# Altium schematic sheet Artix7_ProgramAndConfig.SchDoc
size A2; SheetNumber: 10; SheetTotal: 14
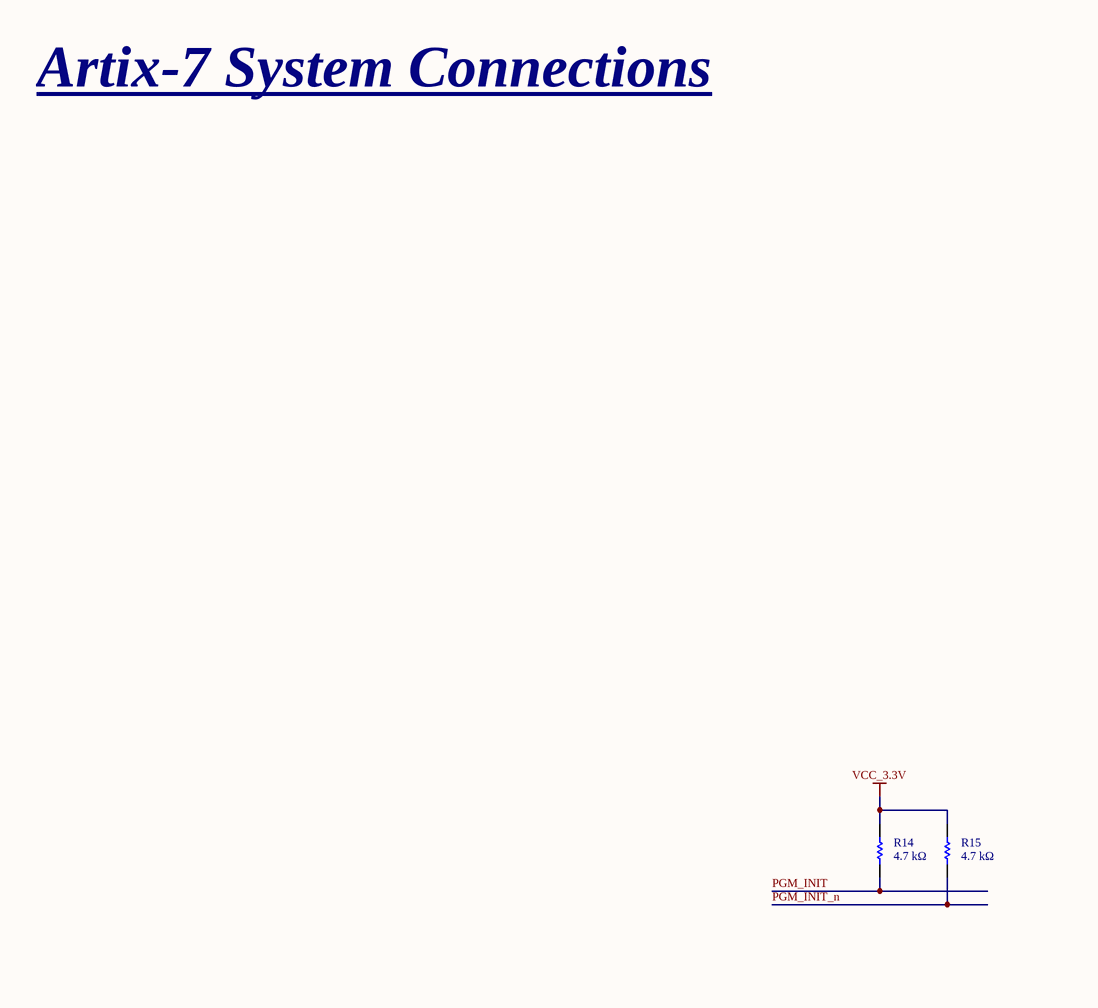
[diagram p0: Artix7_ProgramAndConfig.SchDoc, left]
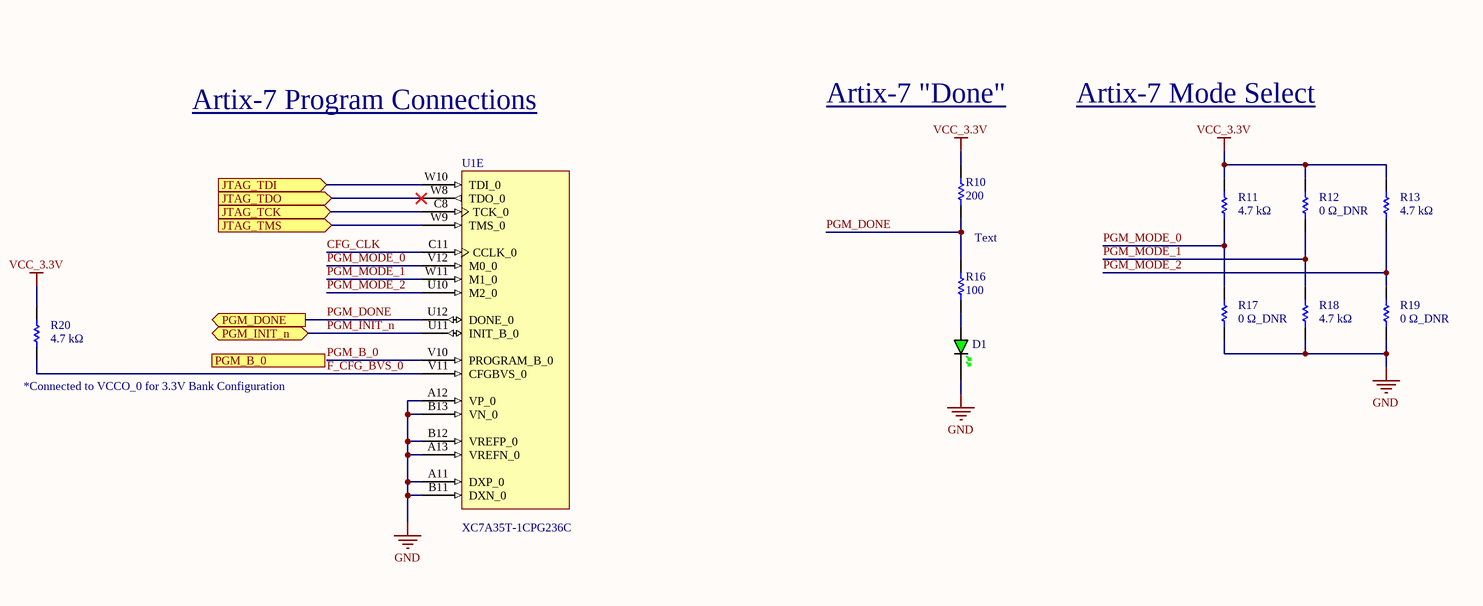
[diagram p1: Artix7_ProgramAndConfig.SchDoc, right]

## Parts
D1  LED_0402_GREEN  [LED_0402_GREEN]  (value not drawn)
R10  value 200  [RESC0402(1005)_L]  (hidden comment: Resistor 200R +/-5 % 0402 63 mW)
R11  Resistance: 4.7 kΩ  [RESC1608X55X30LL15T15]  (hidden comment: ERJ-3EKF4701V)
R12  Resistance: 0 Ω_DNR  [RESC1608X55X30LL15T15]  (hidden comment: ERJ-3EKF4701V)  (no BOM)
R13  Resistance: 4.7 kΩ  [RESC1608X55X30LL15T15]  (hidden comment: ERJ-3EKF4701V)
R14  Resistance: 4.7 kΩ  [RESC1608X55X30LL15T15]  (hidden comment: ERJ-3EKF4701V)
R15  Resistance: 4.7 kΩ  [RESC1608X55X30LL15T15]  (hidden comment: ERJ-3EKF4701V)
R16  value 100  [RESC0402(1005)_L]  (hidden comment: Resistor 100R +/-1 % 0402 63 mW)
R17  Resistance: 0 Ω_DNR  [RESC1608X55X30LL15T15]  (hidden comment: ERJ-3EKF4701V)  (no BOM)
R18  Resistance: 4.7 kΩ  [RESC1608X55X30LL15T15]  (hidden comment: ERJ-3EKF4701V)
R19  Resistance: 0 Ω_DNR  [RESC1608X55X30LL15T15]  (hidden comment: ERJ-3EKF4701V)  (no BOM)
R20  Resistance: 4.7 kΩ  [RESC1608X55X30LL15T15]  (hidden comment: ERJ-3EKF4701V)
U1  XC7A35T-1CPG236C  [CPG236]  (part E of 10)

## Ports
JTAG_TCK (in), JTAG_TDI (in), JTAG_TDO (in), JTAG_TMS (in), PGM_B_0 (in), PGM_DONE (out), PGM_INIT_n (bidir)

## Nets
GND: D1.K R17.1 R18.1 R19.1 U1.A11(DXP_0) U1.A12(VP_0) U1.A13(VREFN_0) U1.B11(DXN_0) U1.B12(VREFP_0) U1.B13(VN_0)
VCC_3.3V: R10.2 R11.2 R12.2 R13.2 R14.2 R15.2 R20.2
CFG_CLK: U1.C11(CCLK_0)
F_CFG_BVS_0: R20.1 U1.V11(CFGBVS_0)
JTAG_TCK: U1.C8(TCK_0) ; port JTAG_TCK
JTAG_TDI: U1.W10(TDI_0) ; port JTAG_TDI
JTAG_TDO: U1.W8(TDO_0) ; port JTAG_TDO
JTAG_TMS: U1.W9(TMS_0) ; port JTAG_TMS
PGM_B_0: U1.V10(PROGRAM_B_0)
PGM_DONE: R10.1 R16.2 U1.U12(DONE_0) ; port PGM_DONE
PGM_INIT: R14.1
PGM_INIT_n: R15.1 U1.U11(INIT_B_0) ; port PGM_INIT_n
PGM_MODE_0: R11.1 R17.2 U1.V12(M0_0)
PGM_MODE_1: R12.1 R18.2 U1.W11(M1_0)
PGM_MODE_2: R13.1 R19.2 U1.U10(M2_0)
NetD1_A: D1.A R16.1

## Notes on the sheet
- Artix-7 System Connections
- Artix-7 "Done"
- Artix-7 Mode Select
- Artix-7 Program Connections
- Text
- (near R20) *Connected to VCCO_0 for 3.3V Bank Configuration

## Library data of the parts
D1 = CMP-004-00056-2: LED 0402 GREEN SMD; Design Item ID: LED_0402_GREEN
R10 = CMP-009-00161-4: Chip Resistor, 200 Ohms, +/-5 %, 63 mW, -55 to 155 degC, 0402; Power: 63mW; Tolerance: 5%; Case/Package: 0402; Max Operating Temperature: 155°C; Pins: 2; Min Operating Temperature: -55°C
R11-R15 R17-R20 = CMP-009-00185-1: Fixed Resistor, Metal Glaze/thick Film, 0.1W, 4700ohm, 75V, 1% +/-Tol, 100ppm/Cel, Surface Mount, 0603; Power: 100mW; Value: 4.7k; Max Operating Temperature: 155°C; Tolerance: 1%; Mounting Technology: Surface Mount; RoHS Compliant: Yes; Min Operating Temperature: -55°C; Case/Package: 0603; Pins: 2
R16 = CMP-009-00167-4: Chip Resistor, 100 Ohms, +/-1 %, 63 mW, -55 to 155 degC, 0402; Power: 63mW; Tolerance: 1%; Min Operating Temperature: -55°C; Max Operating Temperature: 155°C; Case/Package: 0402; Pins: 2
U1 = CMP-0383-00006-1: Artix-7 FPGA, 106 User I/Os, 2 GTP, 238-Ball BGA, Speed Grade 1, Commercial Grade, Pb-Free; Manufacturer: Xilinx; CMTs: 5; Total Block RAM: 1800 Kb; Logic Cells: 33280; Speed Grades: 1; GTP: 2; Available User I/O: 106; ComponentLink1URL: http://www.xilinx.com/; Maximum Distributed RAM: 400 Kb; PackageVersion: Rev. 1.11; PartNumber: XC7A35T-1CPG236C; ComponentLink2URL: http://www.xilinx.com/support/documentation/data_sheets/ds180_7Series_Overview.pdf; DatasheetVersion: Rev. 1.15; ComponentLink1Description: Manufacturer URL; ComponentLink3Description: Pinout; ComponentLink4Description: Package Specification; Mounting Technology: Surface Mount; PackageReference: CPG-236; Operating Temperature Range: Commercial; PackageDescription: 238-Ball Wire-Bond Chip-Scale BGA, Body 10 x10 mm, Pitch 0.5 mm; ComponentLink3URL: http://www.xilinx.com/support/documentation/user_guides/ug475_7Series_Pkg_Pinout.pdf; ComponentLink4URL: http://www.xilinx.com/support/documentation/user_guides/ug475_7Series_Pkg_Pinout.pdf; ComponentLink2Description: Datasheet